# EAGLE design 2_input_v1 (EAGLE 6.4)
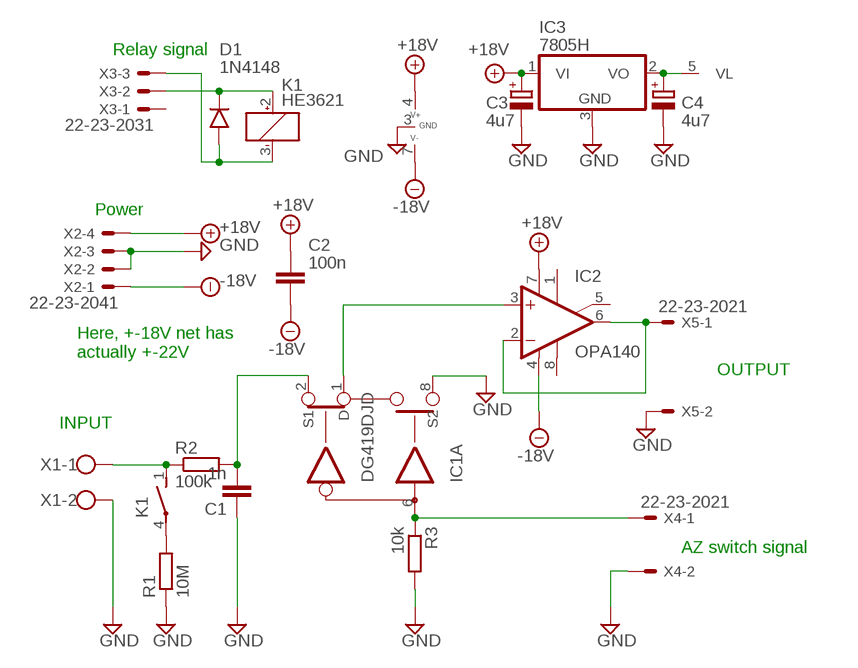
[diagram p0: schematic, sheet 1]

## Parts
C1  1n  C-EU050-025X075  [C050-025X075]
C2  100n  C-EU025-025X050  [C025-025X050]
C3  4u7  CPOL-EUE2.5-5  [E2,5-5]
C4  4u7  CPOL-EUE2.5-5  [E2,5-5]
D1  1N4148  1N4148SOD  [SOD-80]
IC1  DG419DJD  [SO08]
IC2  OPA140  TL071D  [SO08]
IC3  7805H  [TO39]
K1  HE3621  [HE3621]
R1  10M  R193  [R_TR193]
R2  100k  R192  [R_TR192]
R3  10k  R191  [R_TR191]
X1  W237-2N  [W237-2N]
X2  22-23-2041  [22-23-2041]
X3  22-23-2031  [22-23-2031]
X4  22-23-2021  [22-23-2021]
X5  22-23-2021  [22-23-2021]

## Nets
+18V: C2.1 C3.+ IC1.4(P:V+) IC2.7(V+) IC3.1(VI) X2.4
-18V: C2.2 IC1.7(P:V-) IC2.4(V-) X2.1
GND: C1.1 C3.- C4.- IC1.3(P:GND) IC1.8(A:S2) IC3.3(GND) R1.P$1 R3.P$2 X1.2 X2.2 X2.3 X4.2 X5.2
N$5: K1.4(2:P) R1.P$2
N$6: K1.1(2:S) R2.P$1 X1.1
N$7: C1.2 IC1.2(A:S1) R2.P$2
N$8: IC1.1(A:D) IC2.3(+IN)
N$9: D1.K K1.2(1:+) X3.2
N$10: IC2.2(-IN) IC2.6(OUT) X5.1
N$11: C4.+ IC1.5(VL:VL) IC3.2(VO)
N$13: D1.A K1.3(1:-) X3.3
N$15: IC1.6(A:IN) R3.P$1 X4.1
Unconnected: IC2.1(ON1) IC2.5(ON2) IC2.8(OPT) X3.1

## Notes on the sheet
- Relay signal
- Power
- Here, +-18V net has 
  actually +-22V
- OUTPUT
- INPUT
- AZ switch signal

## Library data of the parts
C1 C2 = _rcl:C-EU: CAPACITOR, European symbol
C3 C4 = _rcl:CPOL-EU: POLARIZED CAPACITOR, European symbol
D1 = _mcom6:1N4148
IC1 = linear:DG419DJ: CMOS SWITCH
IC2 = _linear:TL071: OP AMP
IC3 = _linear:78*: Positive VOLTAGE REGULATOR Source: http://cache.national.com/ds/LM/LM78L05.pdf http://www.fairchildsemi.com/ds/LM/LM7805.pdf
K1 = relay:HE3621: RELAY reed, 1 x norm. open, grid 5.08 mm, Hamlin
R1-R3 = _moja:R
X1 = con-wago-508:W237-2N: WAGO SREW CLAMP
X2 = con-molex:22-23-2041: .100" (2.54mm) Center Header - 4 Pin; MF: MOLEX; MPN: 22-23-2041; OC_FARNELL: 1462920; OC_NEWARK: 38C0355
X3 = con-molex:22-23-2031: .100" (2.54mm) Center Header - 3 Pin; MF: MOLEX; MPN: 22-23-2031; OC_FARNELL: 1462950; OC_NEWARK: 30C0862
X4 X5 = con-molex:22-23-2021: .100" (2.54mm) Center Header - 2 Pin; MF: MOLEX; MPN: 22-23-2021; OC_FARNELL: 1462926; OC_NEWARK: 25C3832

## Board
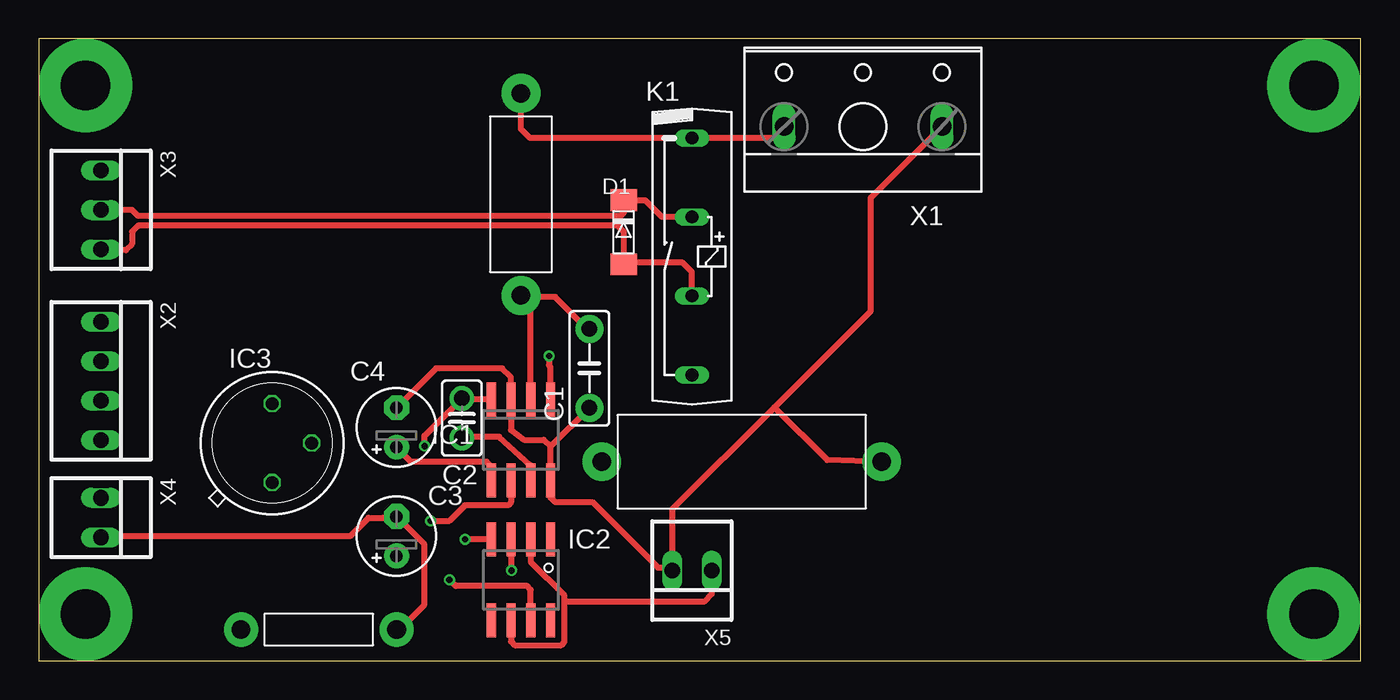
[diagram p1: board, top side]
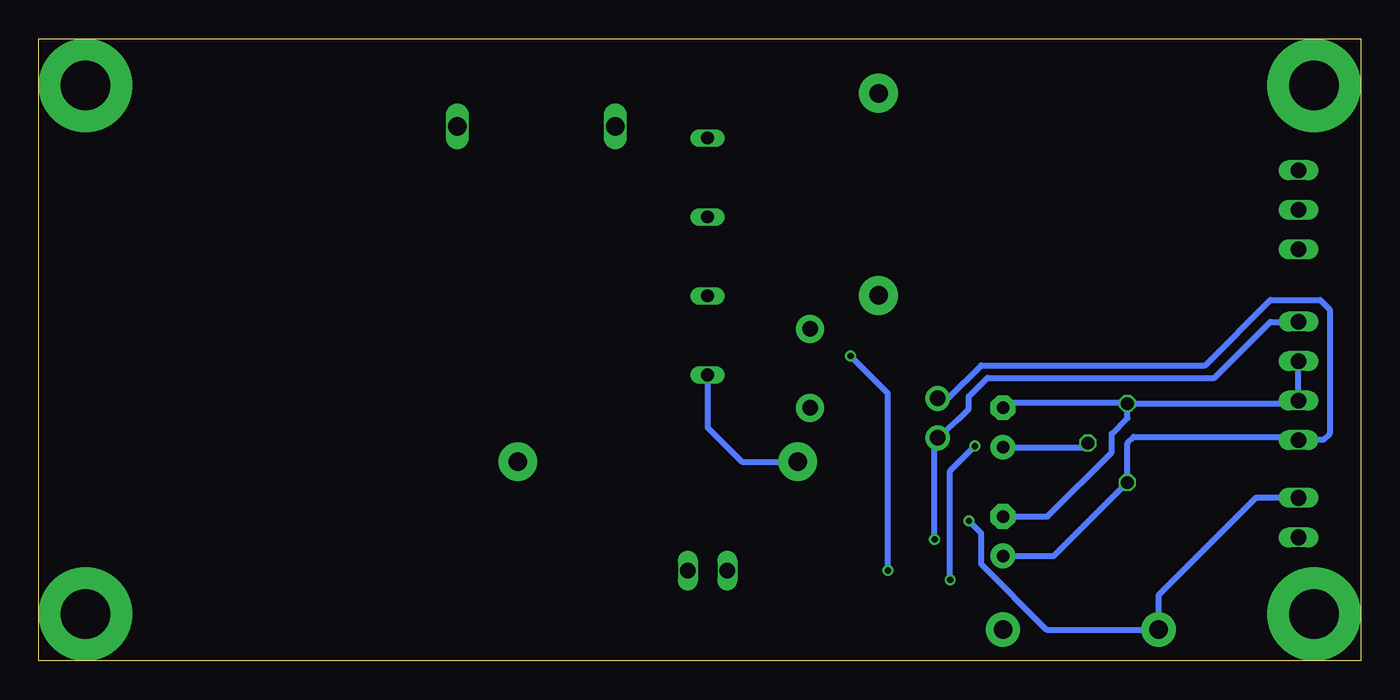
[diagram p2: board, bottom side, seen from below]

Size 85 x 40 mm. Coordinates in mm from the lower left corner, seen from the top.
Outline: 0,0 85,0 85,40 0,40 0,0
Copper layers (1*16): Top 0.035mm / dielectric 1.5mm / Bottom 0.035mm
Design rules "ch_6": minimum track width 0.15mm, minimum drill 0.4mm, track to track 0.2mm, track to pad 0.2mm, pad to pad 0.2mm, via to via 0.2mm, smd to smd 0.2mm, copper to edge 0.6mm, drill to drill 8mil, minimum pad ring 0.15mm, minimum via ring 0.15mm, stop-mask expansion 4mil, vias tented up to drill 0mil, thermal gap 10mil

### Footprints (pad centres in the part's own frame; a part is rotated, then mirrored left to right if it is on the bottom)
C050-025X075 = drill 1 pad 1.8: 1 -2.54,0; 2 2.54,0
C025-025X050 = drill 1 pad 1.6: 1 -1.27,0; 2 1.27,0
E2,5-5 = drill 0.813 pad 1.6: + -1.27,0 | drill 0.813 pad 1.6 octagon: - 1.27,0
SOD-80 = smd 1.397 x 1.702: A 1.905,0; K -2.223,0
SO08 = smd 0.6 x 2.2: 1 -1.905,-2.6; 2 -0.635,-2.6; 3 0.635,-2.6; 4 1.905,-2.6; 5 1.905,2.6; 6 0.635,2.6; 7 -0.635,2.6; 8 -1.905,2.6
TO39 = drill 0.813 octagon: 1 0,-2.54; 2 2.54,0; 3 0,2.54
HE3621 = drill 0.813 long: 1 -7.62,0; 2 -2.54,0; 3 2.54,0; 4 7.62,0
R_TR193 = drill 1.2 pad 2.5: P$1 9,0; P$2 -9,0
R_TR192 = drill 1.2 pad 2.5: P$1 6.5,0; P$2 -6.5,0
R_TR191 = drill 1.2 pad 2.2: P$1 5,0; P$2 -5,0
W237-2N = drill 1.194 long: 1 -5.08,-0.635; 2 5.08,-0.635
22-23-2041 = drill 1 long: 1 -3.81,0; 2 -1.27,0; 3 1.27,0; 4 3.81,0
22-23-2031 = drill 1 long: 1 -2.54,0; 2 0,0; 3 2.54,0
22-23-2021 = drill 1 long: 1 -1.27,0; 2 1.27,0

### Placement (x,y rotation side)
C1  35.4,18.8 90 top
C2  27.2,15.6 270 top
C3  23,8 90 top
C4  23,15 90 top
D1  37.6,27.4 270 top
IC1  31,14.2 180 top
IC2  31,5.2 180 top
IC3  15,14 0 top
K1  42,26 270 top
R1  45.2,12.8 0 top
R2  31,30 90 top
R3  18,2 180 top
X1  53,35 0 top
X2  4,18 270 top
X3  4,29 270 top
X4  4,9.2 270 top
X5  42,5.8 180 top

### Tracks (layer width: path | path; a pad name or v marks a point on that pad's centre or on a via)
+18V  (via drill 0.4)
  Top 0.4: IC1.4 27.27,16.8 C2.1 24.8,14.47 v24.8,13.8 | IC2.7 31.64,4.57 31.4,4.8 26.8,4.8 v26.4,5.2
  Bottom 0.4: C3.+ 19.73,6.73 IC3.1 15,14 14.6,14.4 4.81,14.4 4.6,14.19 X2.4 2.4,14.2 2,14.6 2,22.6 2.6,23.2 5.8,23.2 10,19 24.4,19 26.53,16.87 C2.1 | v26.4,5.2 26.4,12.2 v24.8,13.8
-18V  (via drill 0.4)
  Top 0.4: IC1.7 31.64,12.56 29.6,14.4 27.27,14.4 C2.2 | IC2.4 v27.4,7.8
  Bottom 0.4: v27.4,7.8 27.4,14.13 C2.2 25.87,15.53 25.2,16.2 25.2,17 24,18.2 9.4,18.2 5.8,21.8 X2.1
GND
  Top 0.4: 47.3,16.3 40.73,9.73 X5.2 40.53,6 39.8,6 35.6,10.2 33.2,10.2 32.91,10.49 IC1.8 32.91,13.77 | 47.3,16.3 53.5,22.5 53.5,29.79 X1.2 58.22,34.5 | R3.P$2 23.2,2 24.8,3.6 24.8,7.47 C3.- 22.13,9.2 21.2,9.2 20,8 4.07,8 X4.2 | R1.P$1 50.7,12.9 47.3,16.3 | C4.- 25.53,18.8 29.8,18.8 30.36,18.23 IC1.3 30.36,14.84 31.2,14.2 32.47,14.2 32.91,13.77 | 32.91,13.77 C1.1
  Bottom 0.4: IC3.3 4.19,16.54 X2.3 X2.2 | C3.- 20.13,9.27 16,13.4 16,14.6 15,15.6 IC3.3 | C4.- 22.93,16.27 22.6,16.6 15.06,16.6 IC3.3
N$1  (via drill 3.2 pad 6)
  other vias: 3,3
N$2  (via drill 3.2 pad 6)
  other vias: 3,37
N$3  (via drill 3.2 pad 6)
  other vias: 82,37
N$4  (via drill 3.2 pad 6)
  other vias: 82,3
N$5
  Bottom 0.4: K1.4 42,15 39.8,12.8 R1.P$2
N$6
  Top 0.4: X1.1 47.92,34.12 47.4,33.6 42.02,33.6 K1.1 31.58,33.62 31,34.2 R2.P$1
N$7
  Top 0.4: IC1.2 31.64,22.86 R2.P$2 31.1,23.4 33.2,23.4 35.26,21.34 C1.2
N$8  (via drill 0.4)
  Top 0.4: IC2.3 30.36,5.83 v30.4,5.8 | v32.8,19.6 32.8,19 32.91,18.89 IC1.1
  Bottom 0.4: v30.4,5.8 30.4,17.2 v32.8,19.6
N$9
  Top 0.4: X3.2 6,29 6.4,28.6 37.4,28.6 37.6,28.8 D1.K 37.62,29.6 39,29.6 40.06,28.54 K1.2
N$10
  Top 0.4: IC2.6 30.36,1.24 30.6,1 33.6,1 33.8,1.2 33.8,3.8 | 33.8,3.8 33.8,4.2 31.64,6.37 IC2.2 | X5.1 43.27,4.27 42.8,3.8 33.8,3.8
N$11
  Top 0.4: IC1.5 29.09,12.51 28.8,12.8 23.93,12.8 C4.+
  Bottom 0.4: C4.+ 17.81,13.73 IC3.2
N$13
  Top 0.4: X3.3 4.06,26.4 5.6,26.4 6,26.8 6,27.6 6.4,28 37.2,28 37.6,27.6 D1.A 37.7,25.6 41.4,25.6 42,25 K1.3
N$15  (via drill 0.4)
  Top 0.4: v25.2,9 26.4,9 27.4,10 30.2,10 30.36,10.16 IC1.6
  Bottom 0.4: X4.1 6.73,10.47 13,4.2 R3.P$1 20.2,2 24.4,6.2 24.4,8.2 v25.2,9